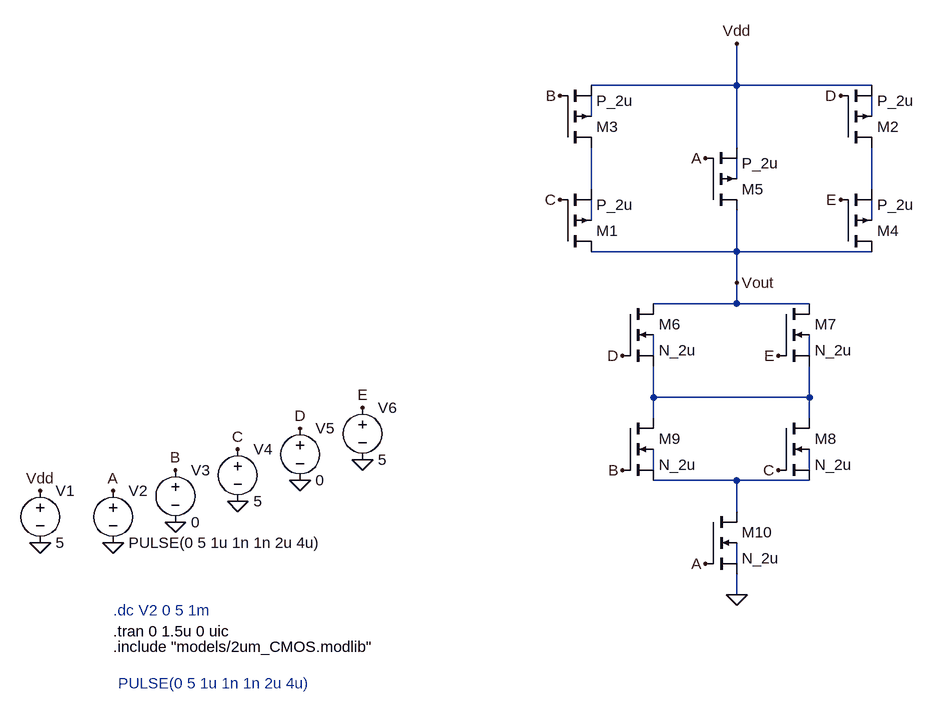
[diagram p0: schematic 2b.asc]
2b.asc, the LTspice schematic file:
Version 4
SHEET 1 880 904
WIRE 128 -32 128 -96
WIRE 128 -32 -96 -32
WIRE 336 -32 128 -32
WIRE -96 16 -96 -16
WIRE 336 16 336 -16
WIRE 128 64 128 -32
WIRE 128 112 128 80
WIRE -96 128 -96 64
WIRE 336 128 336 64
WIRE -96 176 -96 144
WIRE 336 176 336 144
WIRE 128 224 128 160
WIRE 128 224 -96 224
WIRE 336 224 128 224
WIRE 128 272 128 224
WIRE 128 304 128 272
WIRE 128 304 0 304
WIRE 240 304 128 304
WIRE 0 384 0 352
WIRE 240 384 240 352
WIRE 0 448 0 400
WIRE 240 448 240 400
WIRE 240 448 0 448
WIRE 0 480 0 448
WIRE 240 480 240 448
WIRE 0 560 0 528
WIRE 240 560 240 528
WIRE 128 576 0 576
WIRE 240 576 128 576
WIRE 128 624 128 576
WIRE 128 704 128 672
WIRE 128 752 128 720
FLAG 128 -96 Vdd
FLAG 128 752 0
FLAG -944 672 0
FLAG -832 672 0
FLAG -736 640 0
FLAG -640 608 0
FLAG -544 576 0
FLAG -448 544 0
FLAG -944 592 Vdd
FLAG -832 592 A
FLAG 80 80 A
FLAG 80 704 A
FLAG -736 560 B
FLAG -144 -16 B
FLAG -48 560 B
FLAG -640 528 C
FLAG 192 560 C
FLAG -144 144 C
FLAG -544 496 D
FLAG -48 384 D
FLAG 288 -16 D
FLAG -448 464 E
FLAG 288 144 E
FLAG 192 384 E
FLAG 128 272 Vout
SYMBOL voltage -944 576 R0
WINDOW 123 0 0 Left 0
WINDOW 39 0 0 Left 0
SYMATTR InstName V1
SYMATTR Value 5
SYMBOL voltage -832 576 R0
WINDOW 123 0 0 Left 0
WINDOW 39 0 0 Left 0
SYMATTR InstName V2
SYMATTR Value PULSE(0 5 1u 1n 1n 2u 4u)
SYMBOL voltage -736 544 R0
WINDOW 123 0 0 Left 0
WINDOW 39 0 0 Left 0
SYMATTR InstName V3
SYMATTR Value 0
SYMBOL voltage -640 512 R0
WINDOW 123 0 0 Left 0
WINDOW 39 0 0 Left 0
SYMATTR InstName V4
SYMATTR Value 5
SYMBOL voltage -544 480 R0
WINDOW 123 0 0 Left 0
WINDOW 39 0 0 Left 0
SYMATTR InstName V5
SYMATTR Value 0
SYMBOL voltage -448 448 R0
WINDOW 123 0 0 Left 0
WINDOW 39 0 0 Left 0
SYMATTR InstName V6
SYMATTR Value 5
SYMBOL pmos4 -144 64 M180
SYMATTR InstName M3
SYMATTR Value P_2u
SYMATTR Value2 l=2u w=12u
SYMBOL pmos4 -144 224 M180
SYMATTR InstName M1
SYMATTR Value P_2u
SYMATTR Value2 l=2u w=12u
SYMBOL pmos4 288 64 M180
SYMATTR InstName M2
SYMATTR Value P_2u
SYMATTR Value2 l=2u w=12u
SYMBOL pmos4 288 224 M180
SYMATTR InstName M4
SYMATTR Value P_2u
SYMATTR Value2 l=2u w=12u
SYMBOL pmos4 80 160 M180
SYMATTR InstName M5
SYMATTR Value P_2u
SYMATTR Value2 l=2u w=6u
SYMBOL nmos4 -48 304 R0
SYMATTR InstName M6
SYMATTR Value N_2u
SYMATTR Value2 l=2u w=12u
SYMBOL nmos4 192 304 R0
SYMATTR InstName M7
SYMATTR Value N_2u
SYMATTR Value2 l=2u w=12u
SYMBOL nmos4 192 480 R0
SYMATTR InstName M8
SYMATTR Value N_2u
SYMATTR Value2 l=2u w=12u
SYMBOL nmos4 -48 480 R0
SYMATTR InstName M9
SYMATTR Value N_2u
SYMATTR Value2 l=2u w=12u
SYMBOL nmos4 80 624 R0
SYMATTR InstName M10
SYMATTR Value N_2u
SYMATTR Value2 l=2u w=12u
TEXT -832 776 Left 2 ;.dc V2 0 5 1m
TEXT -832 808 Left 2 !.tran 0 1.5u 0 uic
TEXT -832 832 Left 2 !.include "models/2um_CMOS.modlib"
TEXT -824 888 Left 2 ;PULSE(0 5 1u 1n 1n 2u 4u)

The netlist it stands for:
* 2b.asc
V1 Vdd 0 5
V2 A 0 PULSE(0 5 1u 1n 1n 2u 4u)
V3 B 0 0
V4 C 0 5
V5 D 0 0
V6 E 0 5
M3 N004 B Vdd N001 P_2u l=2u w=12u
M1 Vout C N004 N006 P_2u l=2u w=12u
M2 N005 D Vdd N002 P_2u l=2u w=12u
M4 Vout E N005 N007 P_2u l=2u w=12u
M5 Vout A Vdd N003 P_2u l=2u w=6u
M6 Vout D N010 N008 N_2u l=2u w=12u
M7 Vout E N010 N009 N_2u l=2u w=12u
M8 N010 C N013 N012 N_2u l=2u w=12u
M9 N010 B N013 N011 N_2u l=2u w=12u
M10 N013 A 0 N014 N_2u l=2u w=12u
.model NMOS NMOS
.model PMOS PMOS
.lib standard.mos
* .dc V2 0 5 1m
.tran 0 1.5u 0 uic
.include "models/2um_CMOS.modlib"
* PULSE(0 5 1u 1n 1n 2u 4u)
.backanno
.end